# EAGLE design ENR_153_Board (EAGLE 7.2.0)
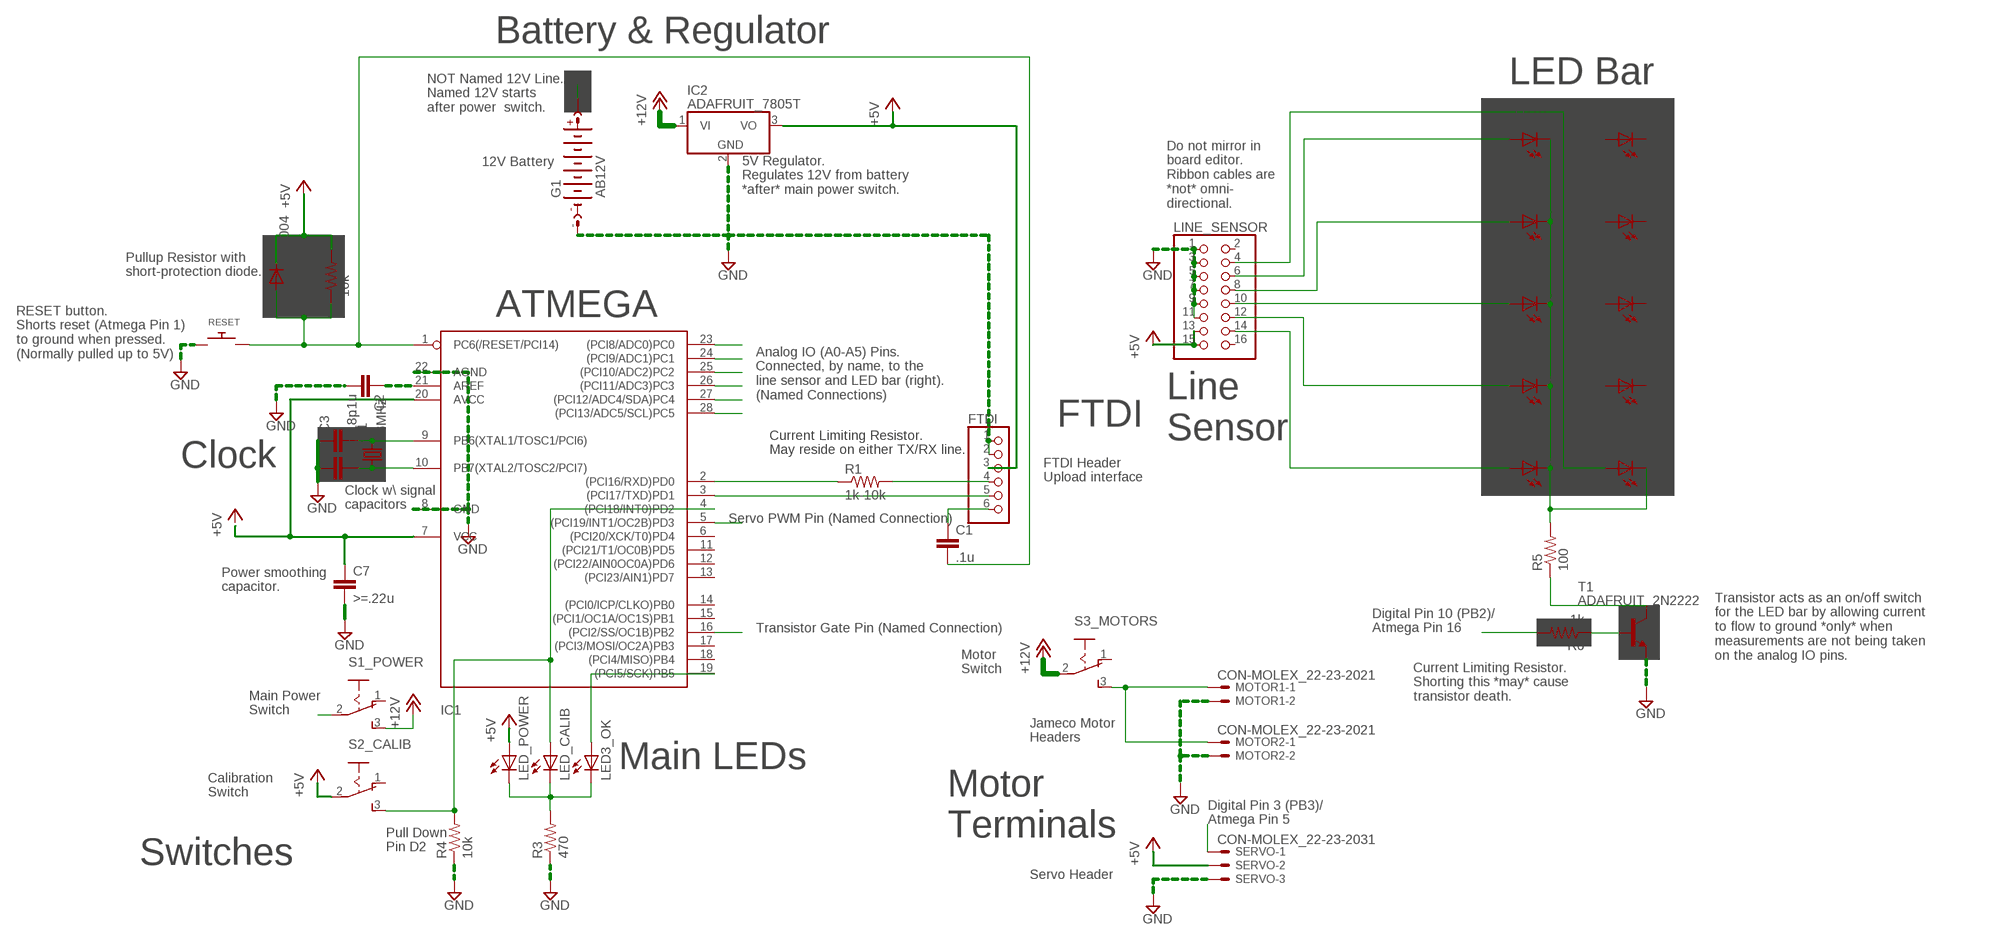
[diagram p0: schematic, sheet 1]

## Parts
C1  .1u  CAPACITOR-WIMA_C5/3  [CAPACITOR-WIMA_C5B3]
C2  .1u  CAPACITOR-WIMA_C5/3  [CAPACITOR-WIMA_C5B3]
C3  18p  CAPACITOR-WIMA_C5/3  [CAPACITOR-WIMA_C5B3]
C4  18p  CAPACITOR-WIMA_C5/3  [CAPACITOR-WIMA_C5B3]
C7  >=.22u  CAPACITOR-WIMA_C5/3  [CAPACITOR-WIMA_C5B3]
D1  1N4004  DIODE_1N4148DO35-7  [DIODE_DO35-7]
DZ1  LB10  [LB10]
FTDI  PINHD-1X6  [1X06]
G1  AB12V  BATTERY_AB9V  [BATTERY_AB9V]
IC1  ATMEGA168V-10P  [DIL28-3]
IC2  ADAFRUIT_7805T  [ADAFRUIT_TO220H]
LED3_OK  ADAFRUIT_LEDSQR2X5  [ADAFRUIT_LED2X5]
LED_CALIB  ADAFRUIT_LEDSQR2X5  [ADAFRUIT_LED2X5]
LED_POWER  ADAFRUIT_LEDSQR2X5  [ADAFRUIT_LED2X5]
LINE_SENSOR  PINHEAD_PINHD-2X8  [PINHEAD_2X08]
MOTOR1  CON-MOLEX_22-23-2021  [CON-MOLEX_22-23-2021]
MOTOR2  CON-MOLEX_22-23-2021  [CON-MOLEX_22-23-2021]
Q1  16MHz  ADAFRUIT_CRYSTALHC49S  [ADAFRUIT_HC49/S]
R1  1k-10k  ADAFRUIT_R-US_0207/7  [ADAFRUIT_0207/7]
R2  10k  ADAFRUIT_R-US_0207/7  [ADAFRUIT_0207/7]
R3  470  ADAFRUIT_R-US_0207/7  [ADAFRUIT_0207/7]
R4  10k  ADAFRUIT_R-US_0207/7  [ADAFRUIT_0207/7]
R5  100  ADAFRUIT_R-US_0207/7  [ADAFRUIT_0207/7]
R6  1k  ADAFRUIT_R-US_0207/7  [ADAFRUIT_0207/7]
RESET  ADAFRUIT_SWITCH_PUSHBUTTONEVQ-PE  [ADAFRUIT_TACT_PANA-EVQ]
S1_POWER  SWITCH_255SB  [SWITCH_255SB]
S2_CALIB  SWITCH_255SB  [SWITCH_255SB]
S3_MOTORS  SWITCH_255SB  [SWITCH_255SB]
SERVO  CON-MOLEX_22-23-2031  [CON-MOLEX_22-23-2031]
T1  ADAFRUIT_2N2222  [ADAFRUIT_TO92-EBC-OVAL]

## Nets
+5V: C7.1 D1.C FTDI.3 IC1.7(VCC) IC1.20(AVCC) IC2.3(VO) LED_POWER.A LINE_SENSOR.13 LINE_SENSOR.15 R2.2 S2_CALIB.2(P) SERVO.2
+12V: IC2.1(VI) S1_POWER.3(S) S3_MOTORS.2(P)
A0: DZ1.6(-6:A) IC1.23((PCI8/ADC0)PC0) LINE_SENSOR.4
A1: DZ1.5(-5:A) IC1.24((PCI9/ADC1)PC1) LINE_SENSOR.6
A2: DZ1.4(-4:A) IC1.25((PCI10/ADC2)PC2) LINE_SENSOR.8
A3: DZ1.3(-3:A) IC1.26((PCI11/ADC3)PC3) LINE_SENSOR.10
A4: DZ1.2(-2:A) IC1.27((PCI12/ADC4/SDA)PC4) LINE_SENSOR.12
A5: DZ1.1(-1:A) IC1.28((PCI13/ADC5/SCL)PC5) LINE_SENSOR.14
GND [Dead Copper Top]: C2.2 C3.1 C4.1 C7.2 FTDI.1 FTDI.2 G1.- IC1.8(GND) IC1.22(AGND) IC2.2(GND) LINE_SENSOR.1 LINE_SENSOR.3 LINE_SENSOR.5 LINE_SENSOR.7 LINE_SENSOR.9 LINE_SENSOR.11 MOTOR1.2 MOTOR2.2 R3.1 R4.1 RESET.P$1 SERVO.3 T1.E
MAINS: G1.+ S1_POWER.2(P)
N$1: C1.2 D1.A IC1.1(PC6(/RESET/PCI14)) R2.1 RESET.P$2
N$3: R5.1 T1.C
N$4: FTDI.4 R1.2
N$5: C1.1 FTDI.6
N$6: IC1.2((PCI16/RXD)PD0) R1.1
N$7: FTDI.5 IC1.3((PCI17/TXD)PD1)
N$8: C2.1 IC1.21(AREF)
N$9: IC1.19((PCI5/SCK)PB5) LED3_OK.A
N$11: LED3_OK.K(C) LED_CALIB.K(C) LED_POWER.K(C) R3.2
N$13: C3.2 IC1.9(PB6(XTAL1/TOSC1/PCI6)) Q1.2
N$14: C4.2 IC1.10(PB7(XTAL2/TOSC2/PCI7)) Q1.1
N$15: R6.1 T1.B
N$18: DZ1.15(-6:C) DZ1.16(-5:C) DZ1.17(-4:C) DZ1.18(-3:C) DZ1.19(-2:C) DZ1.20(-1:C) R5.2
N$21: IC1.4((PCI18/INT0)PD2) LED_CALIB.A R4.2 S2_CALIB.3(S)
N$23: MOTOR1.1 MOTOR2.1 S3_MOTORS.3(S)
SERVO: IC1.5((PCI19/INT1/OC2B)PD3) SERVO.1
TRANSISTOR_GATE: IC1.16((PCI2/SS/OC1B)PB2) R6.2
Unconnected: DZ1.7(-7:A) DZ1.8(-8:A) DZ1.9(-9:A) DZ1.10(-10:A) DZ1.11(-10:C) DZ1.12(-9:C) DZ1.13(-8:C) DZ1.14(-7:C) IC1.6((PCI20/XCK/T0)PD4) IC1.11((PCI21/T1/OC0B)PD5) IC1.12((PCI22/AIN0OC0A)PD6) IC1.13((PCI23/AIN1)PD7) IC1.14((PCI0/ICP/CLKO)PB0) IC1.15((PCI1/OC1A/OC1S)PB1) IC1.17((PCI3/MOSI/OC2A)PB3) IC1.18((PCI4/MISO)PB4) LINE_SENSOR.2 LINE_SENSOR.16 S1_POWER.1(O) S2_CALIB.1(O) S3_MOTORS.1(O)

## Notes on the sheet
- Battery & Regulator
- LED Bar
- NOT Named 12V Line.
  Named 12V starts 
  after power  switch.
- 12V Battery
- 5V Regulator.
  Regulates 12V from battery
  *after* main power switch.
- Do not mirror in 
  board editor. 
  Ribbon cables are
  *not* omni-
  directional.
- Pullup Resistor with 
  short-protection diode.
- ATMEGA
- RESET button.
  Shorts reset (Atmega Pin 1) 
  to ground when pressed. 
  (Normally pulled up to 5V)
- Analog IO (A0-A5) Pins.  
  Connected, by name, to the
  line sensor and LED bar (right).
  (Named Connections)
- FTDI
- Line
  Sensor
- Current Limiting Resistor.
  May reside on either TX/RX line.
- Clock
- FTDI Header
  Upload interface
- Clock w\ signal
  capacitors
- Servo PWM Pin (Named Connection)
- Power smoothing 
  capacitor.
- Transistor Gate Pin (Named Connection)
- Digital Pin 10 (PB2)/
  Atmega Pin 16
- Transistor acts as an on/off switch 
  for the LED bar by allowing current 
  to flow to ground *only* when
  measurements are not being taken 
  on the analog IO pins.
- Motor
  Switch
- Current Limiting Resistor.
  Shorting this *may* cause
  transistor death.
- Main Power 
  Switch
- Jameco Motor 
  Headers
- Main LEDs
- Calibration
  Switch
- Digital Pin 3 (PB3)/
  Atmega Pin 5
- Motor 
  Terminals
- Pull Down
  Pin D2
- Switches
- Servo Header

## Library data of the parts
C1-C4 C7 = mcc:CAPACITOR-WIMA_C: CAPACITOR naming: grid - package width
D1 = mcc:DIODE_1N4148: DIODE high speed (Philips)
DZ1 = led:LB10: LED BLOCK 10-LED bar graph, DIL, Siemens
FTDI = adafruit:PINHD-1X6: PIN HEADER
G1 = mcc:BATTERY_AB9V: 9-V BATTERY CLIP
IC1 = adafruit:ATMEGA168*P: MICROCONTROLLER 16 kBytes FLASH 1 kBytes SRAM 512 Bytes EEPROM USART 8-channel 10 bit ADC
IC2 = mcc:ADAFRUIT_78*: Positive VOLTAGE REGULATOR Added bigger pads to the TO-92 package
LED3_OK LED_CALIB LED_POWER = mcc:ADAFRUIT_LED: LED OSRAM: - CHIPLED LG R971, LG N971, LY N971, LG Q971, LY Q971, LO R971, LY R971 LH N974, LH R974 LS Q976, LO Q976, LY Q976 LO Q996 - Hyper CHIPLED LW Q18S LB Q993, LB Q99A, LB R99A - SideLED LS A670, LO A670, LY A670, LG A670, LP A670 LB A673, LV A673, LT A673, LW A673 LH A674 LY A675 LS A676, LA A676, LO A676, LY A676, LW A676 LS A679, LY A679, LG A679 - Hyper Micro SIDELED® LS Y876, LA Y876, LO Y876, LY Y876 LT Y87S - SmartLED LW L88C, LW L88S LB L89C, LB L89S, LG L890 LS L89K, LO L89K, LY L89K LS L896, LA L896, LO L896, LY L896 - TOPLED LS T670, LO T670, LY T670, LG T670, LP T670 LSG T670, LSP T670, LSY T670, LOP T670, LYG T670 LG T671, LOG T671, LSG T671 LB T673, LV T673, LT T673, LW T673 LH T674 LS T676, LA T676, LO T676, LY T676, LB T676, LH T676, LSB T676, LW T676 LB T67C, LV T67C, LT T67C, LS T67K, LO T67K, LY T67K, LW E67C LS E67B, LA E67B, LO E67B, LY E67B, LB E67C, LV E67C, LT E67C LW T67C LS T679, LY T679, LG T679 LS T770, LO T770, LY T770, LG T770, LP T770 LB T773, LV T773, LT T773, LW T773 LH T774 LS E675, LA E675, LY E675, LS T675 LS T776, LA T776, LO T776, LY T776, LB T776 LHGB T686 LT T68C, LB T68C - Hyper Mini TOPLED® LB M676 - Mini TOPLED Santana® LG M470 LS M47K, LO M47K, LY M47K Source: http://www.osram.convergy.de/
LINE_SENSOR = mcc:PINHEAD_PINHD-2X8: PIN HEADER
MOTOR1 MOTOR2 = mcc:CON-MOLEX_22-23-2021: .100" (2.54mm) Center Header - 2 Pin; MF: MOLEX; MPN: 22-23-2021; OC_FARNELL: 1462926; OC_NEWARK: 25C3832
Q1 = mcc:ADAFRUIT_CRYSTAL: CRYSTAL; OC_FARNELL: 1667008; OC_NEWARK: unknown
R1-R6 = mcc:ADAFRUIT_R-US_: RESISTOR, American symbol
RESET = mcc:ADAFRUIT_SWITCH_PUSHBUTTON: Buttons SOFTTOUCHSMD_SJ - Soft touch temporary push button (Super Junk Akihabara) Compatible with SKPMANE010 [Mouser: 688-SKPMAN] C&K_KSS = Digikey: KSS221GLFS
S1_POWER S2_CALIB S3_MOTORS = mcc:SWITCH_255SB: SLIDING SWITCH Distributor Buerklin, 11G810
SERVO = mcc:CON-MOLEX_22-23-2031: .100" (2.54mm) Center Header - 3 Pin; MF: MOLEX; MPN: 22-23-2031; OC_FARNELL: 1462950; OC_NEWARK: 30C0862
T1 = mcc:ADAFRUIT_2N2222: NPN TRANSISTOR Big oval pads

## Net classes
0 default: width 0.61 mm, clearance 0.61 mm
1 Dead Copper Bottom: width 0.61 mm, clearance 0.61 mm to class 0, clearance 0.61 mm
2 Dead Copper Top: width 0.61 mm, clearance 0.61 mm to class 0

## Board
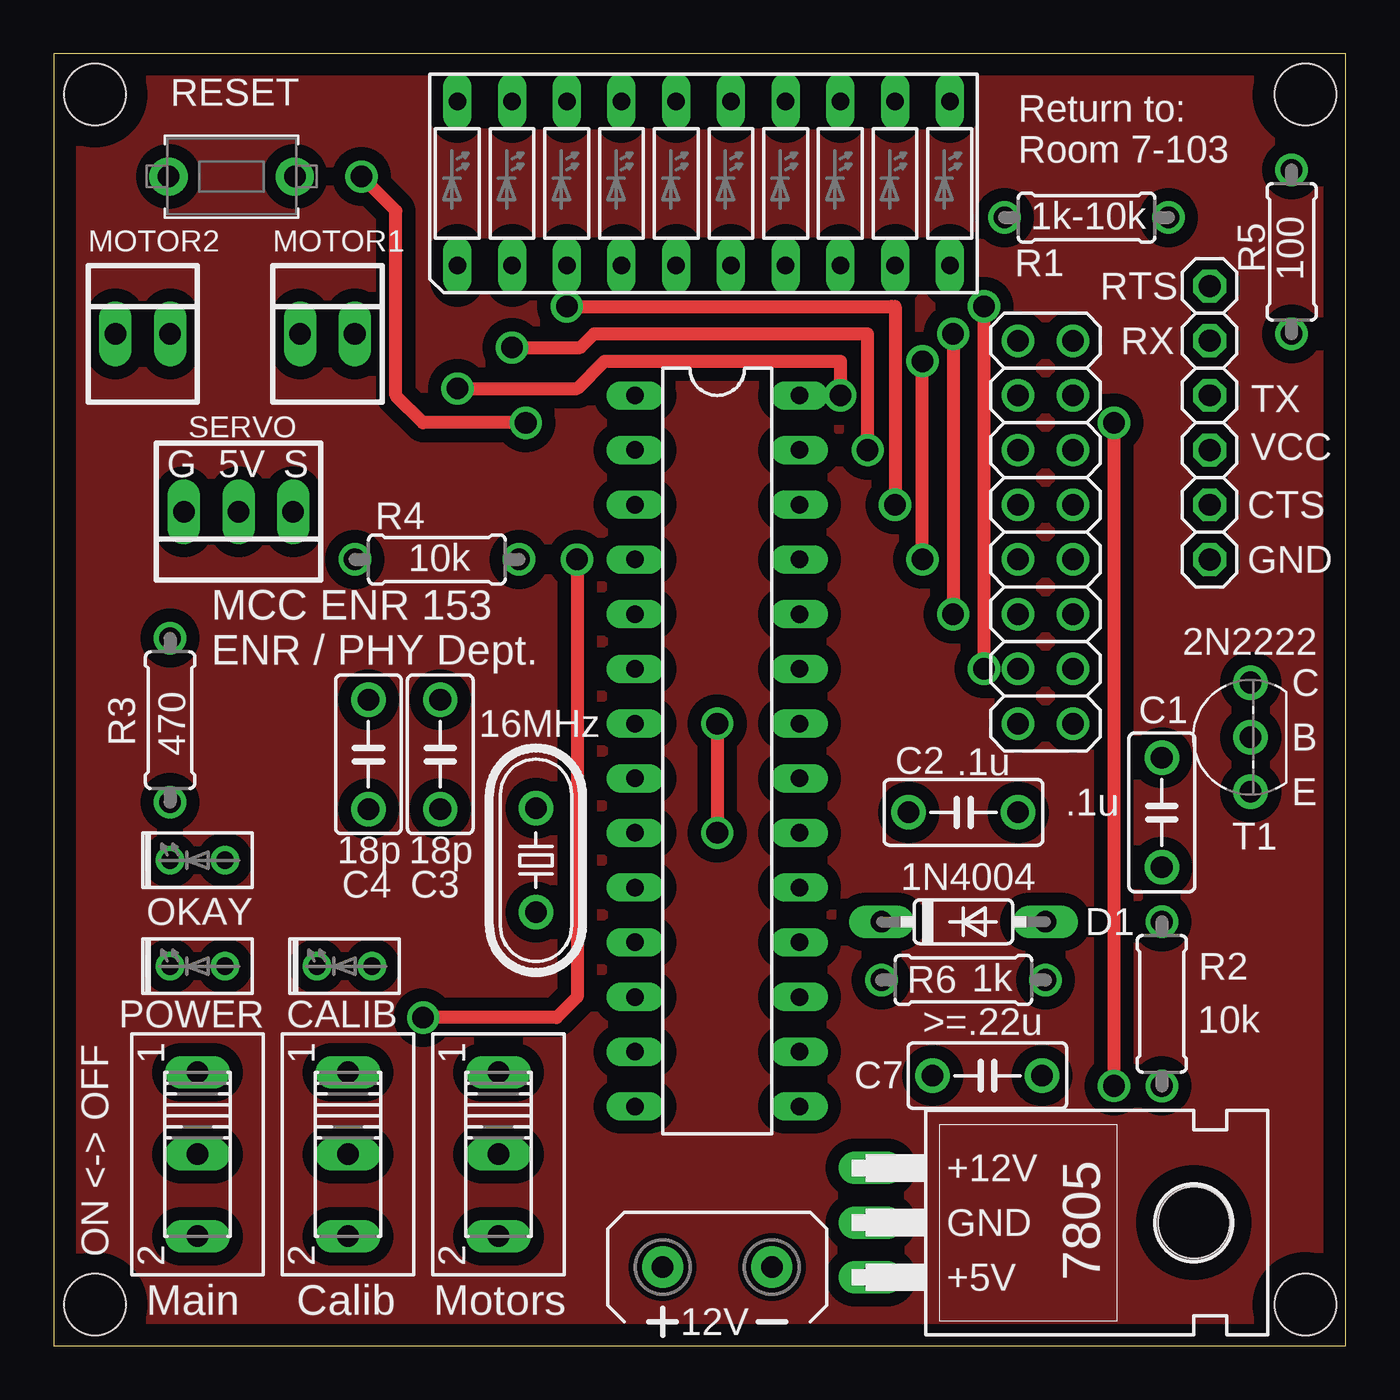
[diagram p1: board, top side]
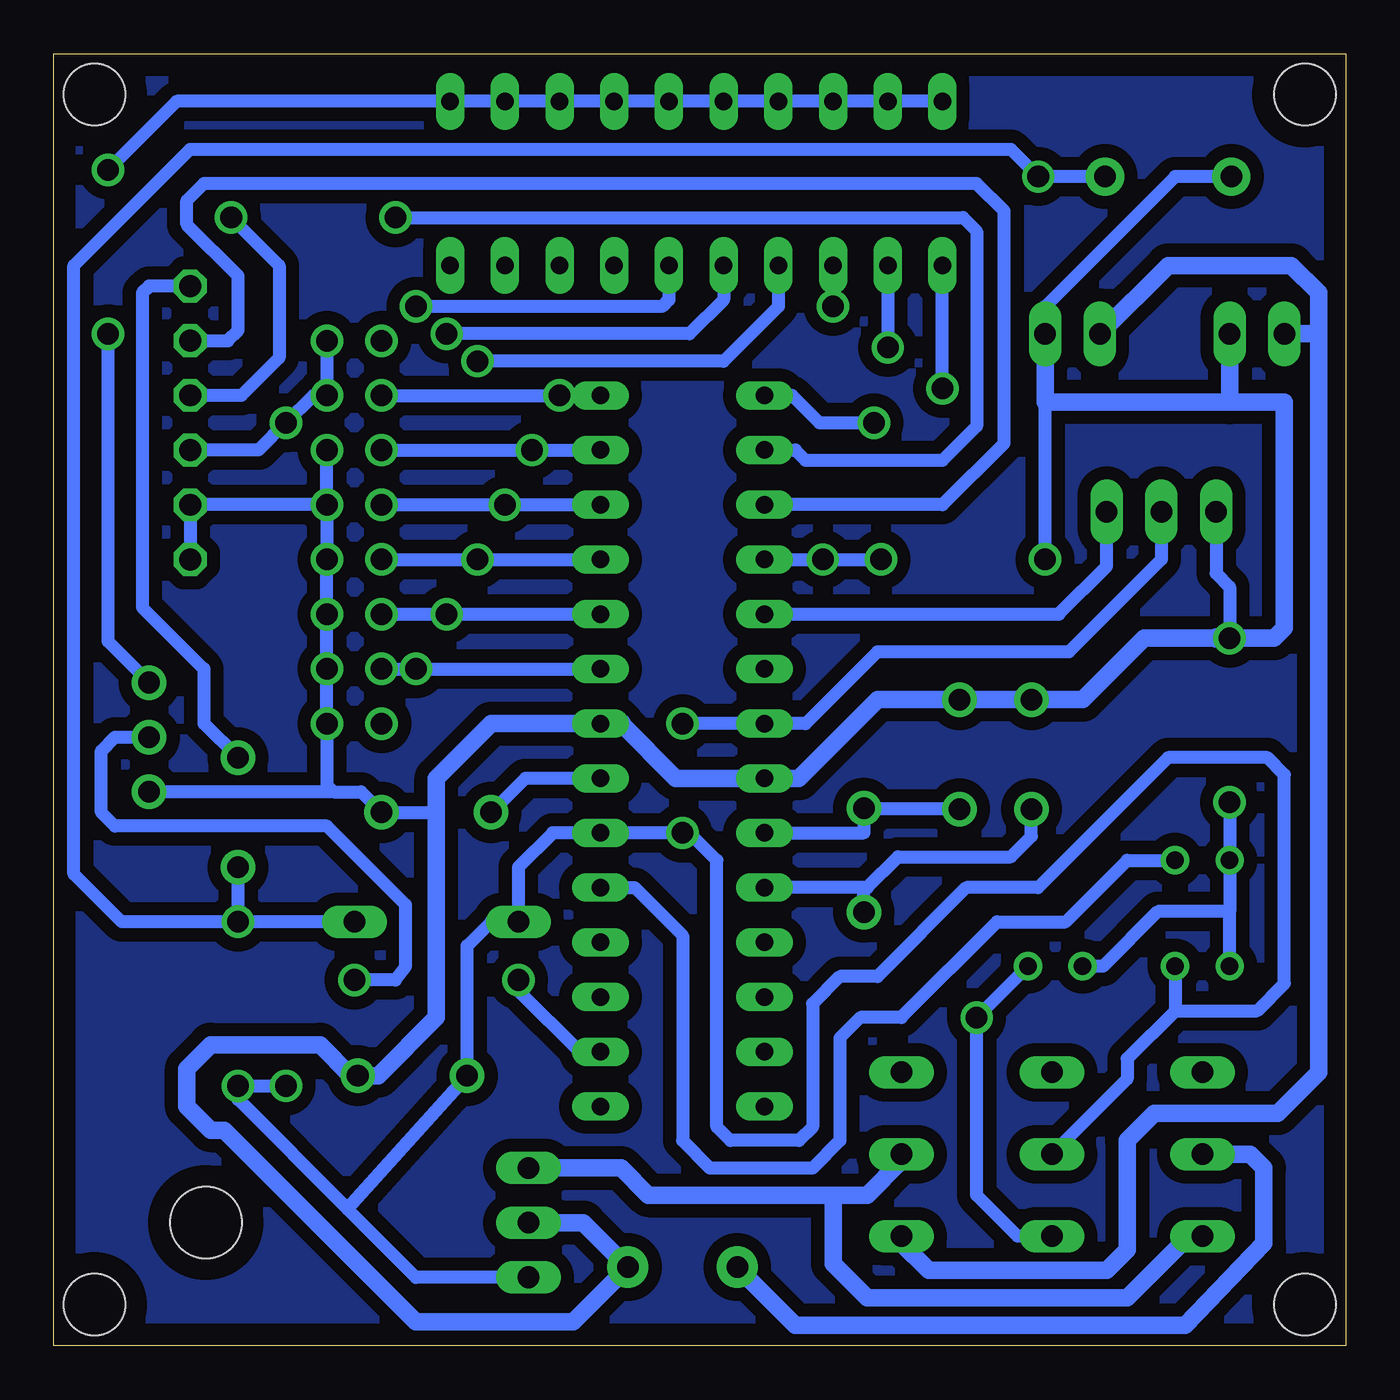
[diagram p2: board, bottom side, seen from below]

Size 59.99 x 59.99 mm. Coordinates in mm from the lower left corner, seen from the top.
Outline: 0,0 59.99,0 59.99,59.99 0,59.99 0,0
Copper layers (1*16): Top 0.035mm / dielectric 1.5mm / Bottom 0.035mm
Design rules "default": minimum track width 10mil, minimum drill 24mil, track to track 8mil, track to pad 8mil, pad to pad 8mil, via to via 8mil, smd to smd 8mil, copper to edge 40mil, drill to drill 8mil, minimum pad ring 10mil, minimum via ring 8mil, stop-mask expansion 4mil, vias tented up to drill 0mil, thermal gap 10mil
Holes 2.84 mm at 1.91,1.91 58.1,1.91 58.1,58.1 1.91,58.1

### Footprints (pad centres in the part's own frame; a part is rotated, then mirrored left to right if it is on the bottom)
CAPACITOR-WIMA_C5B3 = drill 1 pad 1.6: 1 -2.54,0; 2 2.54,0
DIODE_DO35-7 = drill 1 pad 1.143 long: A 3.81,0; C -3.81,0
LB10 = drill 0.813 long: 1 -11.43,-3.81; 2 -8.89,-3.81; 3 -6.35,-3.81; 4 -3.81,-3.81; 5 -1.27,-3.81; 6 1.27,-3.81; 7 3.81,-3.81; 8 6.35,-3.81; 9 8.89,-3.81; 10 11.43,-3.81; 11 11.43,3.81; 12 8.89,3.81; 13 6.35,3.81; 14 3.81,3.81; 15 1.27,3.81; 16 -1.27,3.81; 17 -3.81,3.81; 18 -6.35,3.81; 19 -8.89,3.81; 20 -11.43,3.81
1X06 = drill 1.016 octagon: 1 -6.35,0; 2 -3.81,0; 3 -1.27,0; 4 1.27,0; 5 3.81,0; 6 6.35,0
BATTERY_AB9V = drill 1 pad 1.905: + 0,2.54; - 0,-2.54
DIL28-3 = drill 0.813 long: 1 -16.51,-3.81; 2 -13.97,-3.81; 3 -11.43,-3.81; 4 -8.89,-3.81; 5 -6.35,-3.81; 6 -3.81,-3.81; 7 -1.27,-3.81; 8 1.27,-3.81; 9 3.81,-3.81; 10 6.35,-3.81; 11 8.89,-3.81; 12 11.43,-3.81; 13 13.97,-3.81; 14 16.51,-3.81; 15 16.51,3.81; 16 13.97,3.81; 17 11.43,3.81; 18 8.89,3.81; 19 6.35,3.81; 20 3.81,3.81; 21 1.27,3.81; 22 -1.27,3.81; 23 -3.81,3.81; 24 -6.35,3.81; 25 -8.89,3.81; 26 -11.43,3.81; 27 -13.97,3.81; 28 -16.51,3.81
ADAFRUIT_TO220H = drill 1 long: 1 -2.54,-10.16; 2 0,-10.16; 3 2.54,-10.16 | hole 3.302: 0,4.826
ADAFRUIT_LED2X5 = drill 0.813: A -1.27,0; K 1.27,0
PINHEAD_2X08 = drill 1: 1 -8.89,-1.27; 2 -8.89,1.27; 3 -6.35,-1.27; 4 -6.35,1.27; 5 -3.81,-1.27; 6 -3.81,1.27; 7 -1.27,-1.27; 8 -1.27,1.27; 9 1.27,-1.27; 10 1.27,1.27; 11 3.81,-1.27; 12 3.81,1.27; 13 6.35,-1.27; 14 6.35,1.27; 15 8.89,-1.27; 16 8.89,1.27
CON-MOLEX_22-23-2021 = drill 1 pad 1.27 long: 1 -1.27,0; 2 1.27,0
ADAFRUIT_HC49/S = drill 1 pad 1.6: 1 -2.413,0; 2 2.413,0
ADAFRUIT_0207/7 = drill 1: 1 -3.81,0; 2 3.81,0
ADAFRUIT_TACT_PANA-EVQ = drill 1 pad 1.778: P$1 -2.933,0; P$2 2.933,0
SWITCH_255SB = drill 1 long: 1 -3.81,0; 2 0,0; 3 3.81,0
CON-MOLEX_22-23-2031 = drill 1 pad 1.27 long: 1 -2.54,0; 2 0,0; 3 2.54,0
ADAFRUIT_TO92-EBC-OVAL = drill 1 pad 1.6: B 0,-1.27; C 2.54,-1.27; E -2.54,-1.27

### Placement (x,y rotation side)
C1  51.44,24.77 270 top
C2  42.23,24.77 0 top
C3  17.94,27.46 270 top
C4  14.61,27.46 270 top
C7  43.34,12.54 0 top
D1  42.23,19.68 0 top
DZ1  30.16,53.98 0 top
FTDI  53.66,42.86 90 top
G1  30.8,3.65 90 top
IC1  30.8,27.62 270 top
IC2  48.1,5.71 270 top
LED3_OK  6.67,22.54 180 top
LED_CALIB  13.49,17.62 180 top
LED_POWER  6.67,17.62 180 top
LINE_SENSOR  46.04,37.78 90 top
MOTOR1  12.7,46.99 0 top
MOTOR2  4.13,46.99 0 top
Q1  22.38,22.54 90 top
R1  47.94,52.39 0 top
R2  51.44,15.88 270 top
R3  5.4,29.05 270 top
R4  17.78,36.51 0 top
R5  57.47,50.8 90 top
R6  42.23,16.99 180 top
RESET  8.26,54.29 0 top
S1_POWER  6.67,8.89 270 top
S2_CALIB  13.65,8.89 270 top
S3_MOTORS  20.64,8.89 270 top
SERVO  8.57,38.73 180 top
T1  54.29,28.26 90 top

### Tracks (layer width: path | path; a pad name or v marks a point on that pad's centre or on a via)
+5V  (via drill 1 pad 1.42)
  Top 0.61: v30.8,28.89 v30.8,23.81 | v49.21,42.86 v49.21,12.06
  Bottom 0.61: LINE_SENSOR.15 LINE_SENSOR.13 47.94,44.13 v49.21,42.86 50.48,41.59 FTDI.3 | LED_POWER.A 7.94,15.56 | 7.94,15.56 4.13,15.56 2.86,16.83 2.86,26.51 3.65,27.3 8.26,27.3 14.29,21.27 17.62,21.27 21.75,17.14 23.5,17.14 24.77,15.88 24.77,10.16 25.4,9.53 28.57,9.53 29.21,10.16 29.21,22.54 30.48,23.81 v30.8,23.81 IC1.20 36.83,23.81 38.42,22.23 D1.C 39.69,19.68 40.8,18.57 C7.1 46.35,6.35 | v30.8,28.89 IC1.7 25.08,28.89 21.75,32.23 12.86,32.23 8.57,36.51 SERVO.2 | 7.94,15.56 10.16,13.34 10.16,12.38 S2_CALIB.2 | v49.21,12.06 R2.2 51.44,11.43 46.35,6.35 | IC2.3 43.18,3.17 46.35,6.35
+12V
  Bottom 0.813: S1_POWER.3 7.3,5.08 10.16,2.22 22.23,2.22 23.81,3.81 23.81,6.99 | 23.81,6.99 22.23,6.99 20.64,8.57 S3_MOTORS.2 | IC2.1 33.66,8.26 32.38,6.99 23.81,6.99
A0  (via drill 1 pad 1.42)
  Top 0.61: v43.18,48.26 v43.18,31.43
  Bottom 0.61: LINE_SENSOR.4 v43.18,31.43 IC1.23 | DZ1.6 31.43,48.58 31.75,48.26 v43.18,48.26
A1  (via drill 1 pad 1.42)
  Top 0.61: v41.75,46.99 v41.75,33.97
  Bottom 0.61: LINE_SENSOR.6 v41.75,33.97 IC1.24 | DZ1.5 28.89,48.58 30.48,46.99 v41.75,46.99
A2  (via drill 1 pad 1.42)
  Top 0.61: v40.32,36.51 v40.32,45.72
  Bottom 0.61: LINE_SENSOR.8 v40.32,36.51 IC1.25 | DZ1.4 26.35,48.26 28.89,45.72 v40.32,45.72
A3  (via drill 1 pad 1.42)
  Top 0.61: 39.05,48.26 39.05,48.1 | 39.05,48.1 v39.05,39.05 | v23.81,48.26 38.89,48.26 39.05,48.1
  Bottom 0.61: LINE_SENSOR.10 v39.05,39.05 IC1.26 | DZ1.3 v23.81,48.26
A4  (via drill 1 pad 1.42)
  Top 0.61: v37.78,41.59 37.78,46.83 | 37.78,46.83 37.78,46.99 | v21.27,46.35 24.45,46.35 25.08,46.99 37.62,46.99 37.78,46.83
  Bottom 0.61: LINE_SENSOR.12 v37.78,41.59 IC1.27 | DZ1.2 v21.27,46.35
A5  (via drill 1 pad 1.42)
  Top 0.61: v36.51,44.13 36.51,45.72 25.56,45.72 24.29,44.45 v18.73,44.45
  Bottom 0.61: LINE_SENSOR.14 v36.51,44.13 IC1.28 | v18.73,44.45 DZ1.1
GND
  Bottom 0.61: FTDI.1 FTDI.2 LINE_SENSOR.9 | LINE_SENSOR.9 LINE_SENSOR.11 | LINE_SENSOR.9 LINE_SENSOR.7 LINE_SENSOR.5 LINE_SENSOR.3 LINE_SENSOR.1 47.31,26.04 46.99,25.72 | 46.99,25.72 T1.E | MOTOR1.2 13.97,48.26 7.94,54.29 RESET.P$1 | 42.23,24.77 C2.2 45.72,25.72 46.99,25.72 | R4.1 13.97,43.81 | SERVO.3 6.03,35.88 5.4,35.24 R3.1
  Bottom 0.813: IC1.22 39.69,28.89 42.23,26.35 42.23,24.77 42.23,15.24 44.93,12.54 C7.2 46.2,12.54 47.62,13.97 52.7,13.97 53.82,12.86 53.82,11.11 52.7,10 52.07,10 43.18,1.11 35.88,1.11 G1.- 35.4,5.71 IC2.2 | 33.66,28.89 31.11,26.35 IC1.8 25.4,26.35 21.75,30 C3.1 C4.1 12.22,30 9.37,32.86 R3.1 3.33,32.86 2.86,33.34 2.86,43.81 5.4,43.81 | 5.4,43.81 13.97,43.81 MOTOR1.2 | MOTOR2.2 5.4,43.81
  Bottom 0.914: 6.03,32.86 R3.1 | 33.66,28.89 IC1.22
MAINS
  Bottom 0.813: G1.+ 25.56,0.95 7.46,0.95 3.81,4.76 3.81,8.26 4.45,8.89 S1_POWER.2
N$1  (via drill 1 pad 1.42)
  Top 0.61: v21.91,42.86 17.14,42.86 15.88,44.13 15.88,52.7 v14.29,54.29
  Bottom 0.61: IC1.1 25.72,44.13 24.45,42.86 v21.91,42.86 | R2.1 C1.2 | D1.A R2.1 | R2.1 56.83,19.68 59.05,21.91 59.05,50.16 53.66,55.56 15.56,55.56 v14.29,54.29 RESET.P$2
N$2
  pour Bottom: 0,0 0,60.01 60.01,60.01 60.01,0
N$3
  Bottom 0.61: T1.C 57.47,32.7 R5.1
N$4
  Bottom 0.61: R1.2 49.53,50.16 49.53,45.88 51.28,44.13 FTDI.4
N$5
  Bottom 0.61: FTDI.6 53.98,49.53 53.98,49.21 55.56,49.21 55.88,48.9 55.88,34.29 53.02,31.43 53.02,28.89 C1.1
N$6
  Bottom 0.61: IC1.2 25.56,41.59 25.08,41.12 18.73,41.12 17.14,42.7 17.14,51.75 17.78,52.39 R1.1
N$7
  Bottom 0.61: IC1.3 18.73,39.05 15.88,41.91 15.88,52.7 17.14,53.98 53.02,53.98 53.82,53.18 53.82,52.07 51.44,49.69 51.44,47.15 51.91,46.67 FTDI.5
N$8
  Bottom 0.61: IC1.21 38.1,26.35 C2.1
N$9
  Bottom 0.61: IC1.19 33.02,21.27 30.8,19.05 30.8,9.53 29.53,8.26 24.77,8.26 23.5,9.53 23.5,14.29 22.54,15.24 20.64,15.24 16.19,19.68 13.02,19.68 10.16,22.54 LED3_OK.A
N$11
  Bottom 0.61: R3.2 LED3_OK.K 5.4,20.16 | LED_POWER.K 5.4,20.16 | 5.4,20.16 8.73,20.16 11.27,17.62 LED_CALIB.K
N$12
  pour Top: 0,0 60.01,0 60.01,60.01 0,60.01
N$13
  Bottom 0.61: IC1.9 22.38,23.81 Q1.2 22.35,24.92 C3.2
N$14
  Bottom 0.61: 22.38,21.27 IC1.10 | 22.38,20.16 Q1.1 22.35,20.16 22.38,20.16 | 22.38,20.16 22.38,21.27 | 22.38,21.27 22.23,21.27 20.8,22.7 15.56,22.7 14.61,23.65 C4.2
N$15
  Bottom 0.61: R6.1 44.13,16.99 43.66,17.62 43.66,20.48 47.31,24.13 57.15,24.13 57.78,24.77 57.78,27.62 57.15,28.26 T1.B
N$18
  Bottom 0.61: DZ1.20 DZ1.19 DZ1.18 DZ1.17 DZ1.16 DZ1.15 54.29,57.78 R5.2
N$21  (via drill 1 pad 1.42)
  Top 0.61: v24.29,36.51 24.29,16.19 23.34,15.24 v17.14,15.24
  Bottom 0.61: S2_CALIB.3 15.24,5.08 17.14,6.99 v17.14,15.24 LED_CALIB.A | IC1.4 v24.29,36.51 R4.2
N$23
  Bottom 0.813: 1.27,46.99 1.27,48.9 2.54,50.16 8.26,50.16 MOTOR1.1 | 1.27,46.99 1.27,12.7 3.17,10.79 8.89,10.79 10.16,9.53 10.16,4.45 11.11,3.49 19.37,3.49 20.64,4.76 S3_MOTORS.3 | MOTOR2.1 1.27,46.99
SERVO
  Bottom 0.61: IC1.5 13.34,33.97 11.11,36.2 SERVO.1
TRANSISTOR_GATE
  Bottom 0.61: IC1.16 35.56,13.65 38.42,16.51 R6.2

### Text on the board
tPlace: G | 5V | S
tNames: Return to: / Room 7-103 | RTS | RX | TX | VCC | CTS | GND | 2N2222 | MCC ENR 153 / ENR / PHY Dept. | C | B | E | OKAY | POWER | CALIB | +12V | GND | ON <-> OFF | +5V | 7805 | Main | Calib | Motors